# Altium project V_11_Project.PrjPcb
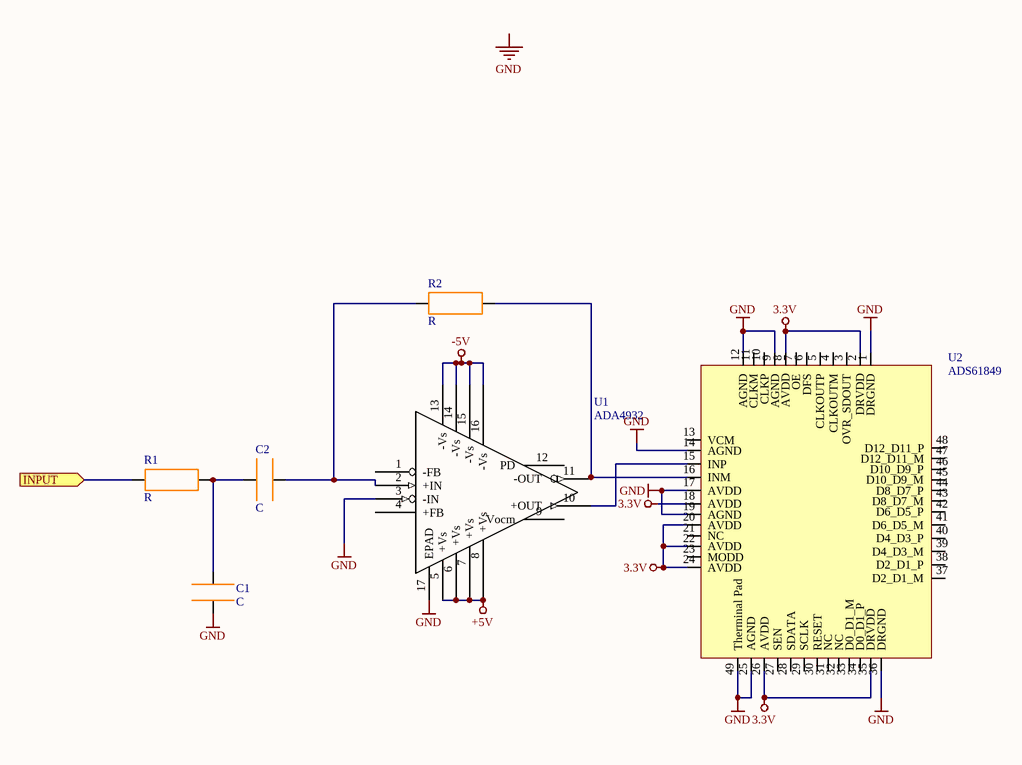
[diagram p0: V_11.SchDoc]
1 sheet, 6 parts. Net scope: flat (ports and power ports of the same name join across sheets).
Board file: V_11.PcbDoc

## Sheet V_11.SchDoc
size A4

### Parts
C1  C  [C_0805]
C2  C  [C_0805]
R1  R  [R_0805]
R2  R  [R_0805]
U1  ADA4932  [ADA4932]
U2  ADS61849  [ADS61B49]

### Ports
INPUT (in)

### Nets
3.3V: U2.2(DRVDD) U2.8(AVDD) U2.18(AVDD) U2.20(AVDD) U2.22(AVDD) U2.24(AVDD) U2.26(AVDD) U2.35(DRVDD)
+5V: U1.5(+Vs) U1.6(+Vs) U1.7(+Vs) U1.8(+Vs)
-5V: U1.13(-Vs) U1.14(-Vs) U1.15(-Vs) U1.16(-Vs)
GND: C1.5 U1.3(-IN) U1.17(EPAD) U2.1(DRGND) U2.9(AGND) U2.12(AGND) U2.14(AGND) U2.17(AVDD) U2.19(AGND) U2.25(AGND) U2.36(DRGND) U2.49(Therminal_Pad)
NetC1_4: C1.4 C2.4 R1.2
NetC2_5: C2.5 R2.1 U1.2(+IN)
NetR1_1: R1.1 ; port INPUT
NetR2_2: R2.2 U1.11(-OUT) U2.16(INM)
NetU1_10: U1.10(+OUT) U2.15(INP)

Not connected (* = marked no-connect by the designer): U1 1(-FB) 4(+FB) 9(Vocm) 12(PD); U2 3(OVR_SDOUT) 4(CLKOUTM) 5(CLKOUTP) 6(DFS) 7(OE) 10(CLKP) 11(CLKM) 13(VCM) 21(NC) 23(MODD) 27(SEN) 28(SDATA) 29(SCLK) 30(RESET) 31(NC) 32(NC) 33(D0_D1_M) 34(D0_D1_P) 37(D2_D1_M) 38(D2_D1_P) 39(D4_D3_M) 40(D4_D3_P) 41(D6_D5_M) 42(D6_D5_P) 43(D8_D7_M) 44(D8_D7_P) 45(D10_D9_M) 46(D10_D9_P) 47(D12_D11_M) 48(D12_D11_P)

### Notes on the sheet
- Labels drawn without touching a wire or pin: GND

### Library data of the parts
U1 = ADA4932: Value: ADA4932